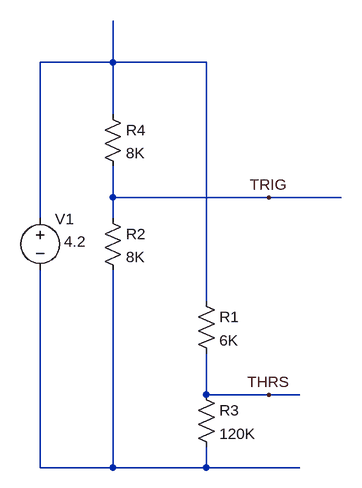
[diagram p0: schematic divider.asc]
divider.asc, the LTspice schematic file:
Version 4
SHEET 1 1952 1524
WIRE -400 80 -400 16
WIRE -400 80 -512 80
WIRE -256 80 -400 80
WIRE -400 160 -400 80
WIRE -400 288 -400 240
WIRE -160 288 -400 288
WIRE -48 288 -160 288
WIRE -512 320 -512 80
WIRE -400 320 -400 288
WIRE -256 448 -256 80
WIRE -256 592 -256 528
WIRE -160 592 -256 592
WIRE -112 592 -160 592
WIRE -512 704 -512 400
WIRE -400 704 -400 400
WIRE -400 704 -512 704
WIRE -256 704 -256 672
WIRE -256 704 -400 704
WIRE -112 704 -256 704
FLAG -160 288 TRIG
FLAG -160 592 THRS
SYMBOL res -272 432 R0
SYMATTR InstName R1
SYMATTR Value 6K
SYMBOL res -416 304 R0
SYMATTR InstName R2
SYMATTR Value 8K
SYMBOL res -272 576 R0
SYMATTR InstName R3
SYMATTR Value 120K
SYMBOL res -416 144 R0
SYMATTR InstName R4
SYMATTR Value 8K
SYMBOL voltage -512 304 R0
WINDOW 3 37 52 Left 2
WINDOW 123 24 138 Left 2
WINDOW 39 18 97 Left 2
WINDOW 0 23 17 Left 2
SYMATTR Value 4.2
SYMATTR InstName V1

The netlist it stands for:
* divider.asc
R1 N001 THRS 6K
R2 TRIG N002 8K
R3 THRS N002 120K
R4 N001 TRIG 8K
V1 N001 N002 4.2
.backanno
.end